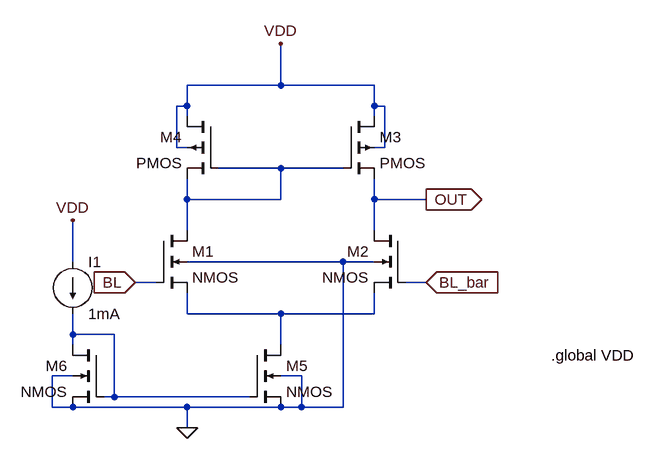
[diagram p0: schematic SRAM_SA.asc]
SRAM_SA.asc, the LTspice schematic file:
Version 4
SHEET 1 1148 2708
WIRE 352 -16 352 -80
WIRE 352 -16 208 -16
WIRE 496 -16 352 -16
WIRE 208 16 208 -16
WIRE 208 16 192 16
WIRE 496 16 496 -16
WIRE 512 16 496 16
WIRE 208 32 208 16
WIRE 496 32 496 16
WIRE 192 80 192 16
WIRE 208 80 192 80
WIRE 512 80 512 16
WIRE 512 80 496 80
WIRE 352 112 256 112
WIRE 448 112 352 112
WIRE 208 160 208 128
WIRE 352 160 352 112
WIRE 352 160 208 160
WIRE 496 160 496 128
WIRE 576 160 496 160
WIRE 208 208 208 160
WIRE 496 208 496 160
WIRE 32 256 32 192
WIRE 448 256 208 256
WIRE 496 256 448 256
WIRE 160 288 128 288
WIRE 576 288 544 288
WIRE 208 336 208 304
WIRE 352 336 208 336
WIRE 496 336 496 304
WIRE 496 336 352 336
WIRE 32 368 32 336
WIRE 96 368 32 368
WIRE 32 384 32 368
WIRE 352 384 352 336
WIRE 32 432 0 432
WIRE 384 432 352 432
WIRE 96 464 96 368
WIRE 96 464 80 464
WIRE 304 464 96 464
WIRE 0 480 0 432
WIRE 32 480 0 480
WIRE 208 480 32 480
WIRE 352 480 208 480
WIRE 384 480 384 432
WIRE 384 480 352 480
WIRE 448 480 448 256
WIRE 448 480 384 480
WIRE 208 512 208 480
FLAG 352 -80 VDD
FLAG 208 512 0
FLAG 32 192 VDD
FLAG 128 288 BL
IOPIN 128 288 In
FLAG 576 160 OUT
IOPIN 576 160 Out
FLAG 576 288 BL_bar
IOPIN 576 288 In
SYMBOL nmos4 160 208 R0
SYMATTR InstName M1
SYMATTR Value2 l=0.25u w=0.375u
SYMBOL nmos4 544 208 M0
SYMATTR InstName M2
SYMATTR Value2 l=0.25u w=0.375u
SYMBOL pmos4 448 32 R0
SYMATTR InstName M3
SYMATTR Value2 l=0.25u w=0.75u
SYMBOL pmos4 256 32 M0
SYMATTR InstName M4
SYMATTR Value2 l=0.25u w=0.75u
SYMBOL nmos4 304 384 R0
SYMATTR InstName M5
SYMATTR Value2 l=0.25u w=0.375u
SYMBOL nmos4 80 384 M0
SYMATTR InstName M6
SYMATTR Value2 l=0.25u w=0.375u
SYMBOL current 32 256 R0
WINDOW 123 0 0 Left 0
WINDOW 39 0 0 Left 0
SYMATTR InstName I1
SYMATTR Value 1mA
TEXT 768 400 Left 2 !.global VDD

The netlist it stands for:
* SRAM_SA.asc
M1 N001 BL N002 0 NMOS l=0.25u w=0.375u
M2 OUT BL_bar N002 0 NMOS l=0.25u w=0.375u
M3 VDD N001 OUT VDD PMOS l=0.25u w=0.75u
M4 VDD N001 N001 VDD PMOS l=0.25u w=0.75u
M5 N002 N003 0 0 NMOS l=0.25u w=0.375u
M6 N003 N003 0 0 NMOS l=0.25u w=0.375u
I1 VDD N003 1mA
.model NMOS NMOS
.model PMOS PMOS
.lib standard.mos
.global VDD
.backanno
.end